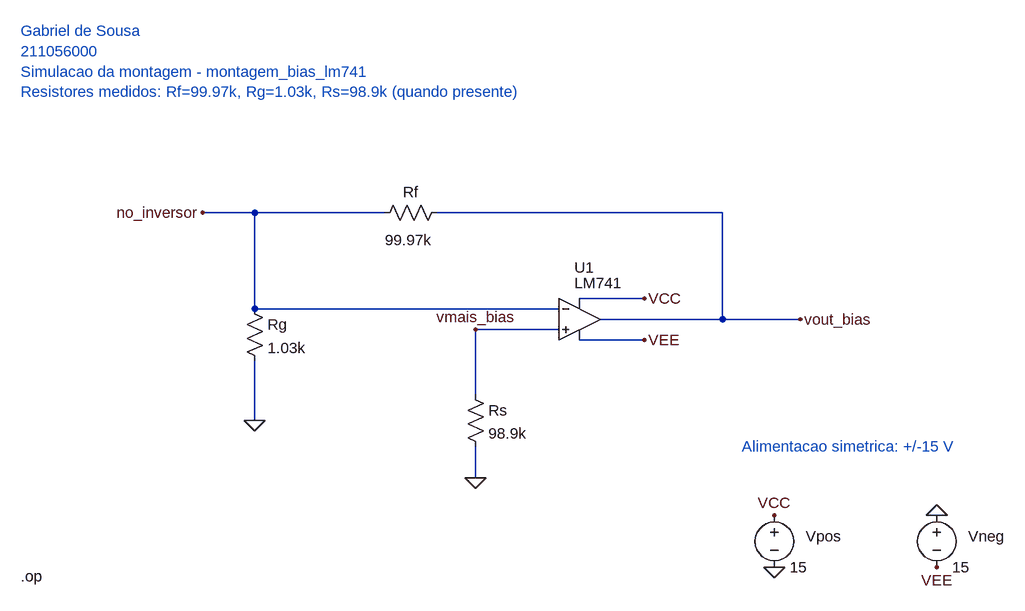
[diagram p0: schematic montagem_bias_lm741.asc]
montagem_bias_lm741.asc, the LTspice schematic file:
Version 4.1
SHEET 1 1600 900
TEXT 40 -80 Left 2 ;Gabriel de Sousa\n211056000\nSimulacao da montagem - montagem_bias_lm741\nResistores medidos: Rf=99.97k, Rg=1.03k, Rs=98.9k (quando presente)
SYMBOL LM741 900 300 R0
WINDOW 0 -8 -16 Left 2
WINDOW 3 -8 8 Left 2
SYMATTR InstName U1
WIRE 900 332 1000 332
FLAG 1000 332 VCC
WIRE 900 396 1000 396
FLAG 1000 396 VEE
WIRE 400 348 868 348
WIRE 400 348 400 200
WIRE 400 200 600 200
WIRE 680 200 1120 200
WIRE 1120 200 1120 364
WIRE 932 364 1240 364
WIRE 400 428 400 520
WIRE 868 380 740 380
WIRE 740 380 740 480
WIRE 740 560 740 608
SYMBOL res 384 332 R0
SYMATTR InstName Rg
SYMATTR Value 1.03k
SYMBOL res 696 184 R90
WINDOW 0 0 56 VBottom 2
WINDOW 3 58 59 VCenter 2
SYMATTR InstName Rf
SYMATTR Value 99.97k
SYMBOL res 724 464 R0
SYMATTR InstName Rs
SYMATTR Value 98.9k
FLAG 400 520 0
FLAG 740 608 0
FLAG 740 380 vmais_bias
FLAG 1240 364 vout_bias
TEXT 1150 560 Left 2 ;Alimentacao simetrica: +/-15 V
SYMBOL voltage 1200 650 R0
WINDOW 0 48 48 Left 2
SYMATTR InstName Vpos
SYMATTR Value 15
SYMBOL voltage 1450 650 R0
WINDOW 0 48 48 Left 2
SYMATTR InstName Vneg
SYMATTR Value 15
FLAG 1200 666 VCC
FLAG 1200 746 0
FLAG 1450 666 0
FLAG 1450 746 VEE
TEXT 40 760 Left 2 !.op
WIRE 320 200 400 200
FLAG 320 200 no_inversor

The netlist it stands for:
* montagem_bias_lm741.asc
X§U1 vmais_bias no_inversor VCC VEE vout_bias LM741  ; pins In+ In- V+ V- OUT
Rg no_inversor 0 1.03k
Rf vout_bias no_inversor 99.97k
Rs vmais_bias 0 98.9k
Vpos VCC 0 15
Vneg 0 VEE 15
* Gabriel de Sousa
* 211056000
* Simulacao da montagem - montagem_bias_lm741
* Resistores medidos: Rf=99.97k, Rg=1.03k, Rs=98.9k (quando presente)
* Alimentacao simetrica: +/-15 V
.op
.lib LM741.lib
.backanno
.end